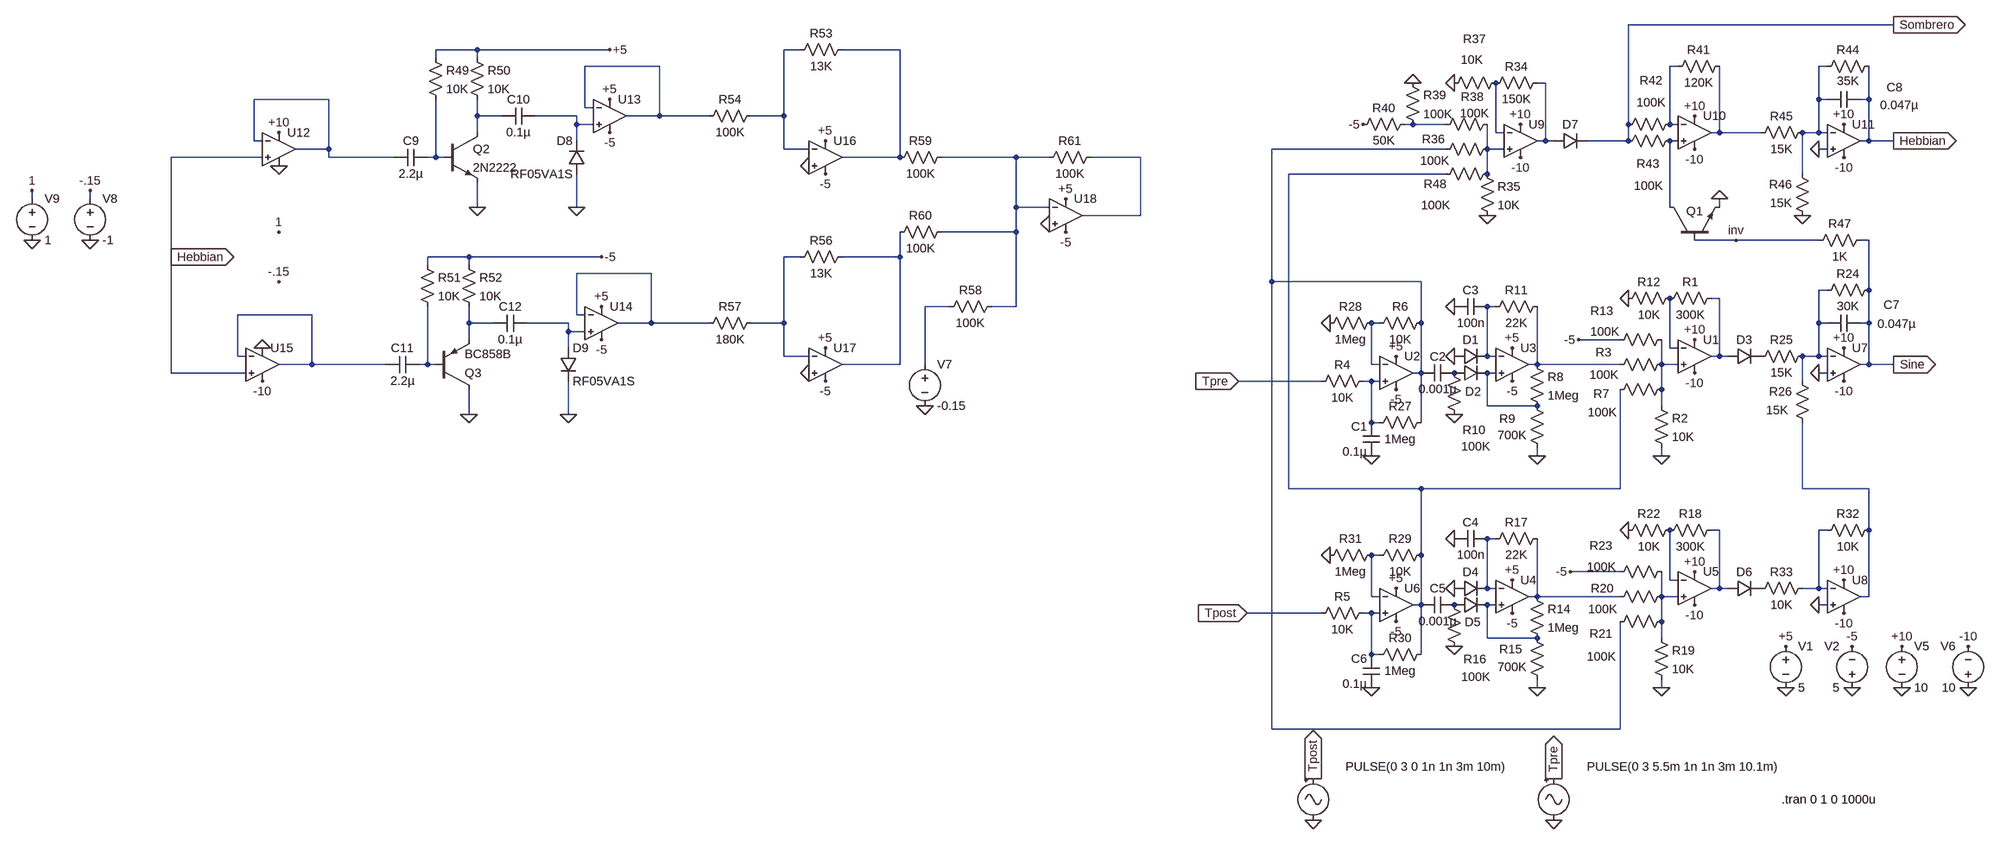
[diagram p0: schematic Draft1.asc]
Draft1.asc, the LTspice schematic file:
Version 4
SHEET 1 884 916
WIRE 704 -640 192 -640
WIRE -3808 -592 -3888 -592
WIRE -3552 -592 -3808 -592
WIRE -3184 -592 -3216 -592
WIRE -2992 -592 -3104 -592
WIRE -3888 -576 -3888 -592
WIRE -3808 -576 -3808 -592
WIRE -3456 -560 -3600 -560
WIRE 288 -560 272 -560
WIRE 576 -560 560 -560
WIRE 32 -528 16 -528
WIRE -4128 -496 -4272 -496
WIRE 560 -496 560 -560
WIRE 576 -496 560 -496
WIRE 656 -496 656 -560
WIRE 656 -496 640 -496
WIRE -3600 -480 -3600 -560
WIRE -3584 -480 -3600 -480
WIRE -3808 -464 -3808 -496
WIRE -3760 -464 -3808 -464
WIRE -3616 -464 -3696 -464
WIRE -3456 -464 -3456 -560
WIRE -3456 -464 -3520 -464
WIRE -3360 -464 -3456 -464
WIRE -3216 -464 -3216 -592
WIRE -3216 -464 -3280 -464
WIRE -3616 -448 -3616 -464
WIRE -3584 -448 -3616 -448
WIRE -224 -448 -240 -448
WIRE -160 -448 -224 -448
WIRE 192 -448 192 -640
WIRE 272 -448 272 -560
WIRE 288 -448 272 -448
WIRE -3808 -432 -3808 -464
WIRE -64 -432 -64 -528
WIRE -48 -432 -64 -432
WIRE 368 -432 368 -560
WIRE 368 -432 352 -432
WIRE 448 -432 368 -432
WIRE 560 -432 560 -496
WIRE 560 -432 528 -432
WIRE 576 -432 560 -432
WIRE -4272 -416 -4272 -496
WIRE -4256 -416 -4272 -416
WIRE -3616 -416 -3616 -448
WIRE 32 -416 32 -528
WIRE 32 -416 16 -416
WIRE 48 -416 32 -416
WIRE 192 -416 192 -448
WIRE 192 -416 112 -416
WIRE 288 -416 272 -416
WIRE 656 -416 656 -496
WIRE 656 -416 640 -416
WIRE 704 -416 656 -416
WIRE -4128 -400 -4128 -496
WIRE -4128 -400 -4192 -400
WIRE -3216 -400 -3216 -464
WIRE -3168 -400 -3216 -400
WIRE -160 -400 -496 -400
WIRE -80 -400 -80 -448
WIRE -48 -400 -80 -400
WIRE 576 -400 560 -400
WIRE -4256 -384 -4432 -384
WIRE -4128 -384 -4128 -400
WIRE -3968 -384 -4128 -384
WIRE -3888 -384 -3888 -496
WIRE -3888 -384 -3904 -384
WIRE -3872 -384 -3888 -384
WIRE -2992 -384 -2992 -592
WIRE -2992 -384 -3104 -384
WIRE -2768 -384 -2912 -384
WIRE -2704 -384 -2768 -384
WIRE -2528 -384 -2624 -384
WIRE -160 -352 -464 -352
WIRE -80 -352 -80 -400
WIRE 528 -352 528 -432
WIRE -4832 -304 -4832 -320
WIRE -4720 -304 -4720 -320
WIRE -3808 -288 -3808 -336
WIRE -3616 -288 -3616 -352
WIRE -2768 -288 -2768 -384
WIRE -2704 -288 -2768 -288
WIRE 272 -288 272 -416
WIRE 368 -288 368 -304
WIRE -2528 -272 -2528 -384
WIRE -2528 -272 -2640 -272
WIRE -2768 -240 -2768 -288
WIRE -2768 -240 -2912 -240
WIRE 400 -224 320 -224
WIRE 560 -224 400 -224
WIRE 656 -224 640 -224
WIRE -4432 -192 -4432 -384
WIRE -3824 -192 -3904 -192
WIRE -3568 -192 -3824 -192
WIRE -3184 -192 -3216 -192
WIRE -2992 -192 -2992 -240
WIRE -2992 -192 -3104 -192
WIRE -3904 -176 -3904 -192
WIRE -3824 -176 -3824 -192
WIRE -3472 -160 -3616 -160
WIRE -496 -144 -496 -400
WIRE -208 -144 -496 -144
WIRE 576 -128 560 -128
WIRE 656 -128 656 -224
WIRE 368 -112 352 -112
WIRE -2896 -96 -2944 -96
WIRE -2768 -96 -2768 -240
WIRE -2768 -96 -2816 -96
WIRE -64 -96 -80 -96
WIRE -4160 -80 -4304 -80
WIRE -3616 -80 -3616 -160
WIRE -3600 -80 -3616 -80
WIRE -3824 -64 -3824 -96
WIRE -3776 -64 -3824 -64
WIRE -3632 -64 -3712 -64
WIRE -3472 -64 -3472 -160
WIRE -3472 -64 -3536 -64
WIRE -3360 -64 -3472 -64
WIRE -3216 -64 -3216 -192
WIRE -3216 -64 -3280 -64
WIRE -288 -64 -304 -64
WIRE -208 -64 -208 -144
WIRE 560 -64 560 -128
WIRE 576 -64 560 -64
WIRE 656 -64 656 -128
WIRE 656 -64 640 -64
WIRE -3632 -48 -3632 -64
WIRE -3600 -48 -3632 -48
WIRE -3824 -32 -3824 -64
WIRE 176 -32 96 -32
WIRE -3632 -16 -3632 -48
WIRE 272 -16 272 -112
WIRE 288 -16 272 -16
WIRE -4304 0 -4304 -80
WIRE -4288 0 -4304 0
WIRE -3216 0 -3216 -64
WIRE -3168 0 -3216 0
WIRE -80 0 -80 -96
WIRE -64 0 -80 0
WIRE 368 0 368 -112
WIRE 368 0 352 0
WIRE 384 0 368 0
WIRE 560 0 560 -64
WIRE 560 0 528 0
WIRE 576 0 560 0
WIRE -4160 16 -4160 -80
WIRE -4160 16 -4224 16
WIRE -3984 16 -4160 16
WIRE -3904 16 -3904 -96
WIRE -3904 16 -3920 16
WIRE -3888 16 -3904 16
WIRE -2992 16 -2992 -192
WIRE -2992 16 -3104 16
WIRE -2944 16 -2944 -96
WIRE -304 16 -304 -64
WIRE -288 16 -304 16
WIRE 16 16 16 -96
WIRE 16 16 0 16
WIRE 176 16 16 16
WIRE 256 16 256 -32
WIRE 288 16 256 16
WIRE 656 16 656 -64
WIRE 656 16 640 16
WIRE 704 16 656 16
WIRE -4432 32 -4432 -192
WIRE -4288 32 -4432 32
WIRE -208 32 -208 -64
WIRE -208 32 -224 32
WIRE -64 32 -80 32
WIRE 576 32 560 32
WIRE -400 48 -560 48
WIRE -304 48 -320 48
WIRE -288 48 -304 48
WIRE 528 48 528 0
WIRE 256 64 256 16
WIRE -80 96 -80 32
WIRE 16 96 -80 96
WIRE 256 96 256 64
WIRE -3824 112 -3824 64
WIRE -3632 112 -3632 48
WIRE -304 128 -304 48
WIRE -288 128 -304 128
WIRE -208 128 -208 32
WIRE 16 192 16 176
WIRE 256 192 256 176
WIRE -464 256 -464 -352
WIRE -208 256 -464 256
WIRE 176 256 176 64
WIRE 176 256 -208 256
WIRE 528 256 528 128
WIRE 656 256 528 256
WIRE 368 336 352 336
WIRE 576 336 560 336
WIRE 656 336 656 256
WIRE -64 352 -80 352
WIRE -288 384 -304 384
WIRE -208 384 -208 256
WIRE 176 416 80 416
WIRE 272 432 272 336
WIRE 288 432 272 432
WIRE -80 448 -80 352
WIRE -64 448 -80 448
WIRE 368 448 368 336
WIRE 368 448 352 448
WIRE 384 448 368 448
WIRE 560 448 560 336
WIRE 560 448 528 448
WIRE 576 448 560 448
WIRE -304 464 -304 384
WIRE -288 464 -304 464
WIRE 16 464 16 352
WIRE 16 464 0 464
WIRE 176 464 16 464
WIRE 256 464 256 416
WIRE 288 464 256 464
WIRE 656 464 656 336
WIRE 656 464 640 464
WIRE -208 480 -208 384
WIRE -208 480 -224 480
WIRE -64 480 -80 480
WIRE 576 480 560 480
WIRE -400 496 -544 496
WIRE -304 496 -320 496
WIRE -288 496 -304 496
WIRE 256 512 256 464
WIRE -80 544 -80 480
WIRE 16 544 -80 544
WIRE 256 544 256 512
WIRE -304 576 -304 496
WIRE -288 576 -304 576
WIRE -208 576 -208 480
WIRE 16 640 16 624
WIRE 256 640 256 624
WIRE -496 720 -496 -144
WIRE 176 720 176 512
WIRE 176 720 -496 720
FLAG 48 896 0
FLAG -416 896 0
FLAG -256 0 +5
FLAG -256 64 -5
FLAG -32 -16 +5
FLAG -32 48 -5
FLAG -144 0 0
FLAG -144 -96 0
FLAG -144 112 0
FLAG 192 -112 0
FLAG 96 -32 -5
FLAG -32 432 +5
FLAG -32 496 -5
FLAG -144 448 0
FLAG -144 352 0
FLAG -144 560 0
FLAG 16 640 0
FLAG 16 192 0
FLAG 192 336 0
FLAG 80 416 -5
FLAG -304 192 0
FLAG -384 -64 0
FLAG -256 448 +5
FLAG -256 512 -5
FLAG -304 640 0
FLAG -384 384 0
FLAG 560 480 0
FLAG 560 32 0
FLAG 256 192 0
FLAG 256 640 0
FLAG 704 16 Sine
IOPIN 704 16 Out
FLAG -144 -528 0
FLAG -224 -528 0
FLAG -320 -448 -5
FLAG 560 -400 0
FLAG 528 -272 0
FLAG 368 -304 0
FLAG 704 -416 Hebbian
IOPIN 704 -416 Out
FLAG 704 -640 Sombrero
IOPIN 704 -640 Out
FLAG 496 640 0
FLAG 624 640 0
FLAG 624 560 -5
FLAG 496 560 +5
FLAG -544 496 Tpost
IOPIN -544 496 In
FLAG -416 816 Tpost
IOPIN -416 816 Out
FLAG -560 48 Tpre
IOPIN -560 48 In
FLAG 48 816 Tpre
IOPIN 48 816 Out
FLAG -80 -272 0
FLAG 400 -224 inv
FLAG 720 640 0
FLAG 848 640 0
FLAG 848 560 -10
FLAG 720 560 +10
FLAG 320 -32 +10
FLAG 608 -16 +10
FLAG 608 432 +10
FLAG 320 416 +10
FLAG 320 480 -10
FLAG 608 496 -10
FLAG 320 32 -10
FLAG 608 48 -10
FLAG -16 -448 +10
FLAG 320 -464 +10
FLAG 608 -448 +10
FLAG 608 -384 -10
FLAG 320 -400 -10
FLAG -16 -384 -10
FLAG -3616 -288 0
FLAG -3808 -288 0
FLAG -3552 -592 +5
FLAG -3552 -496 +5
FLAG -3552 -432 -5
FLAG -3632 112 0
FLAG -3824 112 0
FLAG -3568 -96 +5
FLAG -3568 -32 -5
FLAG -3568 -192 -5
FLAG -3136 -416 +5
FLAG -3136 -352 -5
FLAG -3168 -368 0
FLAG -2944 96 0
FLAG -3136 -16 +5
FLAG -3136 48 -5
FLAG -3168 32 0
FLAG -4432 -192 Hebbian
IOPIN -4432 -192 Out
FLAG -4224 -432 +10
FLAG -4256 48 -10
FLAG -4720 -224 0
FLAG -4720 -320 -.15
FLAG -4224 -144 -.15
FLAG -4832 -224 0
FLAG -4832 -320 1
FLAG -4224 -240 1
FLAG -2672 -304 +5
FLAG -2672 -240 -5
FLAG -2704 -256 0
FLAG -4256 -16 0
FLAG -4224 -368 0
SYMBOL Opamps\\UniversalOpamp2 320 0 R0
SYMATTR InstName U1
SYMBOL res 368 -128 R90
WINDOW 0 0 56 VBottom 2
WINDOW 3 32 56 VTop 2
SYMATTR InstName R1
SYMATTR Value 300K
SYMBOL res 240 80 R0
SYMATTR InstName R2
SYMATTR Value 10K
SYMBOL res 272 0 R90
WINDOW 0 8 128 VBottom 2
WINDOW 3 20 127 VTop 2
SYMATTR InstName R3
SYMATTR Value 100K
SYMBOL Opamps\\UniversalOpamp2 -256 32 R0
SYMATTR InstName U2
SYMBOL cap -288 192 R180
WINDOW 0 24 56 Left 2
WINDOW 3 24 8 Left 2
SYMATTR InstName C1
SYMATTR Value 0.1µ
SYMBOL res -304 32 R90
WINDOW 0 0 56 VBottom 2
WINDOW 3 32 56 VTop 2
SYMATTR InstName R4
SYMATTR Value 10K
SYMBOL res -304 480 R90
WINDOW 0 0 56 VBottom 2
WINDOW 3 32 56 VTop 2
SYMATTR InstName R5
SYMATTR Value 10K
SYMBOL res -192 -80 R90
WINDOW 0 0 56 VBottom 2
WINDOW 3 32 56 VTop 2
SYMATTR InstName R6
SYMATTR Value 10K
SYMBOL res 272 48 R90
WINDOW 0 40 132 VBottom 2
WINDOW 3 45 130 VTop 2
SYMATTR InstName R7
SYMATTR Value 100K
SYMBOL Opamps\\UniversalOpamp2 -32 16 R0
SYMATTR InstName U3
SYMBOL diode -144 16 R270
WINDOW 0 32 32 VTop 2
WINDOW 3 0 32 Invisible 2
SYMATTR InstName D1
SYMBOL diode -144 48 R270
WINDOW 0 -36 37 VTop 2
WINDOW 3 0 32 Invisible 2
SYMATTR InstName D2
SYMBOL res 0 0 R0
SYMATTR InstName R8
SYMATTR Value 1Meg
SYMBOL res 32 192 R180
WINDOW 0 58 71 Left 2
WINDOW 3 36 40 Left 2
SYMATTR InstName R9
SYMATTR Value 700K
SYMBOL res -160 16 R0
WINDOW 0 32 126 Left 2
WINDOW 3 30 158 Left 2
SYMATTR InstName R10
SYMATTR Value 100K
SYMBOL cap -144 16 R90
WINDOW 0 0 32 VBottom 2
WINDOW 3 32 32 VTop 2
SYMATTR InstName C2
SYMATTR Value 0.001µ
SYMBOL res 32 -112 R90
WINDOW 0 0 56 VBottom 2
WINDOW 3 32 56 VTop 2
SYMATTR InstName R11
SYMATTR Value 22K
SYMBOL cap -80 -112 R90
WINDOW 0 0 32 VBottom 2
WINDOW 3 32 32 VTop 2
SYMATTR InstName C3
SYMATTR Value 100n
SYMBOL res 176 -96 R270
WINDOW 0 32 56 VTop 2
WINDOW 3 0 56 VBottom 2
SYMATTR InstName R12
SYMATTR Value 10K
SYMBOL diode 384 16 R270
WINDOW 0 32 32 VTop 2
WINDOW 3 0 32 Invisible 2
SYMATTR InstName D3
SYMBOL res 272 -48 R90
WINDOW 0 -24 131 VBottom 2
WINDOW 3 -15 125 VTop 2
SYMATTR InstName R13
SYMATTR Value 100K
SYMBOL Opamps\\UniversalOpamp2 -32 464 R0
SYMATTR InstName U4
SYMBOL diode -144 464 R270
WINDOW 0 32 32 VTop 2
WINDOW 3 0 32 Invisible 2
SYMATTR InstName D4
SYMBOL diode -144 496 R270
WINDOW 0 -33 36 VTop 2
WINDOW 3 0 32 Invisible 2
SYMATTR InstName D5
SYMBOL res 0 448 R0
SYMATTR InstName R14
SYMATTR Value 1Meg
SYMBOL res 32 640 R180
WINDOW 0 45 74 Left 2
WINDOW 3 36 40 Left 2
SYMATTR InstName R15
SYMATTR Value 700K
SYMBOL res -160 464 R0
WINDOW 0 34 121 Left 2
WINDOW 3 30 155 Left 2
SYMATTR InstName R16
SYMATTR Value 100K
SYMBOL res 32 336 R90
WINDOW 0 0 56 VBottom 2
WINDOW 3 32 56 VTop 2
SYMATTR InstName R17
SYMATTR Value 22K
SYMBOL cap -80 336 R90
WINDOW 0 0 32 VBottom 2
WINDOW 3 32 32 VTop 2
SYMATTR InstName C4
SYMATTR Value 100n
SYMBOL cap -144 464 R90
WINDOW 0 0 32 VBottom 2
WINDOW 3 32 32 VTop 2
SYMATTR InstName C5
SYMATTR Value 0.001µ
SYMBOL Opamps\\UniversalOpamp2 320 448 R0
SYMATTR InstName U5
SYMBOL res 368 320 R90
WINDOW 0 0 56 VBottom 2
WINDOW 3 32 56 VTop 2
SYMATTR InstName R18
SYMATTR Value 300K
SYMBOL res 240 528 R0
SYMATTR InstName R19
SYMATTR Value 10K
SYMBOL res 272 448 R90
WINDOW 0 16 130 VBottom 2
WINDOW 3 25 129 VTop 2
SYMATTR InstName R20
SYMATTR Value 100K
SYMBOL res 272 496 R90
WINDOW 0 55 133 VBottom 2
WINDOW 3 68 132 VTop 2
SYMATTR InstName R21
SYMATTR Value 100K
SYMBOL res 176 352 R270
WINDOW 0 32 56 VTop 2
WINDOW 3 0 56 VBottom 2
SYMATTR InstName R22
SYMATTR Value 10K
SYMBOL diode 384 464 R270
WINDOW 0 32 32 VTop 2
WINDOW 3 0 32 Invisible 2
SYMATTR InstName D6
SYMBOL res 272 400 R90
WINDOW 0 -19 133 VBottom 2
WINDOW 3 -9 132 VTop 2
SYMATTR InstName R23
SYMATTR Value 100K
SYMBOL res 672 -144 R90
WINDOW 0 0 56 VBottom 2
WINDOW 3 32 56 VTop 2
SYMATTR InstName R24
SYMATTR Value 30K
SYMBOL res 544 -16 R90
WINDOW 0 0 56 VBottom 2
WINDOW 3 32 56 VTop 2
SYMATTR InstName R25
SYMATTR Value 15K
SYMBOL res 544 144 R180
WINDOW 0 36 76 Left 2
WINDOW 3 43 40 Left 2
SYMATTR InstName R26
SYMATTR Value 15K
SYMBOL res -192 112 R90
WINDOW 0 0 56 VBottom 2
WINDOW 3 32 56 VTop 2
SYMATTR InstName R27
SYMATTR Value 1Meg
SYMBOL res -288 -80 R90
WINDOW 0 0 56 VBottom 2
WINDOW 3 32 56 VTop 2
SYMATTR InstName R28
SYMATTR Value 1Meg
SYMBOL Opamps\\UniversalOpamp2 -256 480 R0
SYMATTR InstName U6
SYMBOL cap -288 640 R180
WINDOW 0 24 56 Left 2
WINDOW 3 24 8 Left 2
SYMATTR InstName C6
SYMATTR Value 0.1µ
SYMBOL res -192 368 R90
WINDOW 0 0 56 VBottom 2
WINDOW 3 32 56 VTop 2
SYMATTR InstName R29
SYMATTR Value 10K
SYMBOL res -192 560 R90
WINDOW 0 0 56 VBottom 2
WINDOW 3 32 56 VTop 2
SYMATTR InstName R30
SYMATTR Value 1Meg
SYMBOL res -288 368 R90
WINDOW 0 0 56 VBottom 2
WINDOW 3 32 56 VTop 2
SYMATTR InstName R31
SYMATTR Value 1Meg
SYMBOL Opamps\\UniversalOpamp2 608 16 R0
SYMATTR InstName U7
SYMBOL res 672 320 R90
WINDOW 0 0 56 VBottom 2
WINDOW 3 32 56 VTop 2
SYMATTR InstName R32
SYMATTR Value 10K
SYMBOL Opamps\\UniversalOpamp2 608 464 R0
SYMATTR InstName U8
SYMBOL res 544 432 R90
WINDOW 0 0 56 VBottom 2
WINDOW 3 32 56 VTop 2
SYMATTR InstName R33
SYMATTR Value 10K
SYMBOL cap 640 -80 R90
WINDOW 0 -4 -60 VBottom 2
WINDOW 3 2 -70 VTop 2
SYMATTR InstName C7
SYMATTR Value 0.047µ
SYMBOL Opamps\\UniversalOpamp2 -16 -416 R0
SYMATTR InstName U9
SYMATTR SpiceModel level.3b
SYMBOL res 32 -544 R90
WINDOW 0 0 56 VBottom 2
WINDOW 3 32 56 VTop 2
SYMATTR InstName R34
SYMATTR Value 150K
SYMBOL res -96 -368 R0
SYMATTR InstName R35
SYMATTR Value 10K
SYMBOL res -64 -416 R90
WINDOW 0 12 120 VBottom 2
WINDOW 3 23 117 VTop 2
SYMATTR InstName R36
SYMATTR Value 100K
SYMBOL res -160 -512 R270
WINDOW 0 85 55 VTop 2
WINDOW 3 76 50 VBottom 2
SYMATTR InstName R37
SYMATTR Value 10K
SYMBOL res -64 -464 R90
WINDOW 0 -21 45 VBottom 2
WINDOW 3 -21 41 VTop 2
SYMATTR InstName R38
SYMATTR Value 100K
SYMBOL res -240 -544 R0
SYMATTR InstName R39
SYMATTR Value 100K
SYMBOL res -224 -464 R90
WINDOW 0 0 56 VBottom 2
WINDOW 3 32 56 VTop 2
SYMATTR InstName R40
SYMATTR Value 50K
SYMBOL diode 48 -400 R270
WINDOW 0 32 32 VTop 2
WINDOW 3 0 32 Invisible 2
SYMATTR InstName D7
SYMBOL res 384 -576 R90
WINDOW 0 0 56 VBottom 2
WINDOW 3 32 56 VTop 2
SYMATTR InstName R41
SYMATTR Value 120K
SYMBOL Opamps\\UniversalOpamp2 320 -432 R0
SYMATTR InstName U10
SYMBOL res 288 -464 R90
WINDOW 0 -53 52 VBottom 2
WINDOW 3 -42 52 VTop 2
SYMATTR InstName R42
SYMATTR Value 100K
SYMBOL res 288 -432 R90
WINDOW 0 76 58 VBottom 2
WINDOW 3 87 57 VTop 2
SYMATTR InstName R43
SYMATTR Value 100K
SYMBOL npn 272 -224 R270
WINDOW 0 56 32 VRight 2
WINDOW 3 56 68 Invisible 2
SYMATTR InstName Q1
SYMBOL res 672 -576 R90
WINDOW 0 0 56 VBottom 2
WINDOW 3 60 56 VBottom 2
SYMATTR InstName R44
SYMATTR Value 35K
SYMBOL res 544 -448 R90
WINDOW 0 0 56 VBottom 2
WINDOW 3 32 56 VTop 2
SYMATTR InstName R45
SYMATTR Value 15K
SYMBOL res 544 -256 R180
WINDOW 0 36 76 Left 2
WINDOW 3 36 40 Left 2
SYMATTR InstName R46
SYMATTR Value 15K
SYMBOL Opamps\\UniversalOpamp2 608 -416 R0
SYMATTR InstName U11
SYMBOL cap 640 -512 R90
WINDOW 0 8 -66 VBottom 2
WINDOW 3 11 -75 VTop 2
SYMATTR InstName C8
SYMATTR Value 0.047µ
SYMBOL res 544 -208 R270
WINDOW 0 32 56 VTop 2
WINDOW 3 0 56 VBottom 2
SYMATTR InstName R47
SYMATTR Value 1K
SYMBOL voltage 496 544 R0
WINDOW 123 0 0 Left 2
WINDOW 39 0 0 Left 2
SYMATTR InstName V1
SYMATTR Value 5
SYMBOL voltage 624 656 R180
WINDOW 0 24 96 Left 2
WINDOW 3 24 16 Left 2
WINDOW 123 0 0 Left 2
WINDOW 39 0 0 Left 2
SYMATTR InstName V2
SYMATTR Value 5
SYMBOL Misc\\signal -416 800 R0
WINDOW 0 24 16 Invisible 2
WINDOW 3 62 -8 Left 2
WINDOW 123 0 0 Left 2
WINDOW 39 0 0 Left 2
SYMATTR InstName V3
SYMATTR Value PULSE(0 3 0 1n 1n 3m 10m)
SYMBOL Misc\\signal 48 800 R0
WINDOW 0 24 16 Invisible 2
WINDOW 3 64 -8 Left 2
WINDOW 123 0 0 Left 2
WINDOW 39 0 0 Left 2
SYMATTR InstName V4
SYMATTR Value PULSE(0 3 5.5m 1n 1n 3m 10.1m)
SYMBOL res -64 -368 R90
WINDOW 0 51 117 VBottom 2
WINDOW 3 61 116 VTop 2
SYMATTR InstName R48
SYMATTR Value 100K
SYMBOL voltage 720 544 R0
WINDOW 123 0 0 Left 2
WINDOW 39 0 0 Left 2
SYMATTR InstName V5
SYMATTR Value 10
SYMBOL voltage 848 656 R180
WINDOW 0 24 96 Left 2
WINDOW 3 24 16 Left 2
WINDOW 123 0 0 Left 2
WINDOW 39 0 0 Left 2
SYMATTR InstName V6
SYMATTR Value 10
SYMBOL cap -3904 -400 R90
WINDOW 0 0 32 VBottom 2
WINDOW 3 32 32 VTop 2
SYMATTR InstName C9
SYMATTR Value 2.2µ
SYMBOL res -3904 -592 R0
SYMATTR InstName R49
SYMATTR Value 10K
SYMBOL res -3824 -592 R0
SYMATTR InstName R50
SYMATTR Value 10K
SYMBOL npn -3872 -432 R0
SYMATTR InstName Q2
SYMATTR Value 2N2222
SYMBOL cap -3696 -480 R90
WINDOW 0 0 32 VBottom 2
WINDOW 3 32 32 VTop 2
SYMATTR InstName C10
SYMATTR Value 0.1µ
SYMBOL diode -3600 -352 R180
WINDOW 0 24 64 Left 2
WINDOW 3 24 0 Left 2
SYMATTR InstName D8
SYMATTR Value RF05VA1S
SYMBOL Opamps\\UniversalOpamp2 -4224 -400 R0
SYMATTR InstName U12
SYMBOL Opamps\\UniversalOpamp2 -3552 -464 R0
SYMATTR InstName U13
SYMBOL cap -3920 0 R90
WINDOW 0 0 32 VBottom 2
WINDOW 3 32 32 VTop 2
SYMATTR InstName C11
SYMATTR Value 2.2µ
SYMBOL res -3920 -192 R0
SYMATTR InstName R51
SYMATTR Value 10K
SYMBOL res -3840 -192 R0
SYMATTR InstName R52
SYMATTR Value 10K
SYMBOL cap -3712 -80 R90
WINDOW 0 0 32 VBottom 2
WINDOW 3 32 32 VTop 2
SYMATTR InstName C12
SYMATTR Value 0.1µ
SYMBOL diode -3648 -16 R0
SYMATTR InstName D9
SYMATTR Value RF05VA1S
SYMBOL Opamps\\UniversalOpamp2 -3568 -64 R0
SYMATTR InstName U14
SYMBOL pnp -3888 64 M180
SYMATTR InstName Q3
SYMATTR Value BC858B
SYMBOL Opamps\\UniversalOpamp2 -4256 16 R0
SYMATTR InstName U15
SYMBOL Opamps\\UniversalOpamp2 -3136 -384 R0
SYMATTR InstName U16
SYMBOL res -3088 -608 R90
WINDOW 0 0 56 VBottom 2
WINDOW 3 32 56 VTop 2
SYMATTR InstName R53
SYMATTR Value 13K
SYMBOL res -3264 -480 R90
WINDOW 0 0 56 VBottom 2
WINDOW 3 32 56 VTop 2
SYMATTR InstName R54
SYMATTR Value 100K
SYMBOL voltage -2944 0 R0
WINDOW 123 0 0 Left 2
WINDOW 39 0 0 Left 2
SYMATTR InstName V7
SYMATTR Value -0.15
SYMBOL Opamps\\UniversalOpamp2 -3136 16 R0
SYMATTR InstName U17
SYMBOL res -3088 -208 R90
WINDOW 0 0 56 VBottom 2
WINDOW 3 32 56 VTop 2
SYMATTR InstName R56
SYMATTR Value 13K
SYMBOL res -3264 -80 R90
WINDOW 0 0 56 VBottom 2
WINDOW 3 32 56 VTop 2
SYMATTR InstName R57
SYMATTR Value 180K
SYMBOL res -2800 -112 R90
WINDOW 0 0 56 VBottom 2
WINDOW 3 32 56 VTop 2
SYMATTR InstName R58
SYMATTR Value 100K
SYMBOL voltage -4720 -320 R0
WINDOW 123 0 0 Left 2
WINDOW 39 0 0 Left 2
SYMATTR InstName V8
SYMATTR Value -1
SYMBOL voltage -4832 -320 R0
WINDOW 123 0 0 Left 2
WINDOW 39 0 0 Left 2
SYMATTR InstName V9
SYMATTR Value 1
SYMBOL Opamps\\UniversalOpamp2 -2672 -272 R0
SYMATTR InstName U18
SYMBOL res -2896 -400 R90
WINDOW 0 0 56 VBottom 2
WINDOW 3 32 56 VTop 2
SYMATTR InstName R59
SYMATTR Value 100K
SYMBOL res -2896 -256 R90
WINDOW 0 0 56 VBottom 2
WINDOW 3 32 56 VTop 2
SYMATTR InstName R60
SYMATTR Value 100K
SYMBOL res -2608 -400 R90
WINDOW 0 0 56 VBottom 2
WINDOW 3 32 56 VTop 2
SYMATTR InstName R61
SYMATTR Value 100K
TEXT 488 856 Left 2 !.tran 0 1 0 1000u

The netlist it stands for:
* Draft1.asc
XU1 N034 N031 +10 -10 N024 level.2 Avol=1Meg GBW=10Meg Slew=10Meg ilimit=25m rail=0 Vos=0 phimargin=45 en=0 enk=0 in=0 ink=0 Rin=500Meg  ; pins IN+ IN- V+ V- OUT
R1 N024 N031 300K
R2 N034 0 10K
R3 N034 N033 100K
XU2 N036 N030 +5 -5 N014 level.2 Avol=1Meg GBW=10Meg Slew=10Meg ilimit=25m rail=0 Vos=0 phimargin=45 en=0 enk=0 in=0 ink=0 Rin=500Meg  ; pins IN+ IN- V+ V- OUT
C1 0 N036 0.1µ
R4 N036 Tpre 10K
R5 N046 Tpost 10K
R6 N014 N030 10K
R7 N034 N019 100K
XU3 N035 N026 +5 -5 N033 level.2 Avol=1Meg GBW=10Meg Slew=10Meg ilimit=25m rail=0 Vos=0 phimargin=45 en=0 enk=0 in=0 ink=0 Rin=500Meg  ; pins IN+ IN- V+ V- OUT
D1 0 N026 D
D2 P001 N035 D
R8 N033 N035 1Meg
R9 0 N035 700K
R10 P001 0 100K
C2 P001 N014 0.001µ
R11 N033 N026 22K
C3 N026 0 100n
R12 0 N031 10K
D3 N024 P002 D
R13 N034 -5 100K
XU4 N045 N040 +5 -5 N043 level.2 Avol=1Meg GBW=10Meg Slew=10Meg ilimit=25m rail=0 Vos=0 phimargin=45 en=0 enk=0 in=0 ink=0 Rin=500Meg  ; pins IN+ IN- V+ V- OUT
D4 0 N040 D
D5 P003 N045 D
R14 N043 N045 1Meg
R15 0 N045 700K
R16 P003 0 100K
R17 N043 N040 22K
C4 N040 0 100n
C5 P003 N019 0.001µ
XU5 N044 N042 +10 -10 N038 level.2 Avol=1Meg GBW=10Meg Slew=10Meg ilimit=25m rail=0 Vos=0 phimargin=45 en=0 enk=0 in=0 ink=0 Rin=500Meg  ; pins IN+ IN- V+ V- OUT
R18 N038 N042 300K
R19 N044 0 10K
R20 N044 N043 100K
R21 N044 N014 100K
R22 0 N042 10K
D6 N038 P004 D
R23 N044 -5 100K
R24 Sine N023 30K
R25 N023 P002 15K
R26 N037 N023 15K
R27 N014 N036 1Meg
R28 N030 0 1Meg
XU6 N046 N041 +5 -5 N019 level.2 Avol=1Meg GBW=10Meg Slew=10Meg ilimit=25m rail=0 Vos=0 phimargin=45 en=0 enk=0 in=0 ink=0 Rin=500Meg  ; pins IN+ IN- V+ V- OUT
C6 0 N046 0.1µ
R29 N019 N041 10K
R30 N019 N046 1Meg
R31 N041 0 1Meg
XU7 0 N023 +10 -10 Sine level.2 Avol=1Meg GBW=10Meg Slew=10Meg ilimit=25m rail=0 Vos=0 phimargin=45 en=0 enk=0 in=0 ink=0 Rin=500Meg  ; pins IN+ IN- V+ V- OUT
R32 N037 N039 10K
XU8 0 N039 +10 -10 N037 level.2 Avol=1Meg GBW=10Meg Slew=10Meg ilimit=25m rail=0 Vos=0 phimargin=45 en=0 enk=0 in=0 ink=0 Rin=500Meg  ; pins IN+ IN- V+ V- OUT
R33 N039 P004 10K
C7 Sine N023 0.047µ
XU9 N015 N011 +10 -10 N006 level.3b Avol=1Meg GBW=10Meg Slew=10Meg ilimit=25m rail=0 Vos=0 phimargin=45 en=0 enk=0 in=0 ink=0 Rin=500Meg  ; pins IN+ IN- V+ V- OUT
R34 N006 N011 150K
R35 N015 0 10K
R36 N015 N014 100K
R37 0 N011 10K
R38 N015 N010 100K
R39 0 N010 100K
R40 N010 -5 50K
D7 N006 Sombrero D
R41 N012 N004 120K
XU10 N013 N004 +10 -10 N012 level.2 Avol=1Meg GBW=10Meg Slew=10Meg ilimit=25m rail=0 Vos=0 phimargin=45 en=0 enk=0 in=0 ink=0 Rin=500Meg  ; pins IN+ IN- V+ V- OUT
R42 N004 Sombrero 100K
R43 N013 Sombrero 100K
Q1 N013 inv 0 0 NPN
R44 Hebbian N005 35K
R45 N005 N012 15K
R46 0 N005 15K
XU11 0 N005 +10 -10 Hebbian level.2 Avol=1Meg GBW=10Meg Slew=10Meg ilimit=25m rail=0 Vos=0 phimargin=45 en=0 enk=0 in=0 ink=0 Rin=500Meg  ; pins IN+ IN- V+ V- OUT
C8 Hebbian N005 0.047µ
R47 inv Sine 1K
V1 +5 0 5
V2 0 -5 5
V3 Tpost 0 PULSE(0 3 0 1n 1n 3m 10m)
V4 Tpre 0 PULSE(0 3 5.5m 1n 1n 3m 10.1m)
R48 N015 N019 100K
V5 +10 0 10
V6 0 -10 10
C9 N016 N007 2.2µ
R49 +5 N016 10K
R50 +5 N008 10K
Q2 N008 N016 0 0 2N2222
C10 N009 N008 0.1µ
D8 0 N009 RF05VA1S
XU12 Hebbian N007 +10 0 N007 level.2 Avol=1Meg GBW=10Meg Slew=10Meg ilimit=25m rail=0 Vos=0 phimargin=45 en=0 enk=0 in=0 ink=0 Rin=500Meg  ; pins IN+ IN- V+ V- OUT
XU13 N009 N003 +5 -5 N003 level.2 Avol=1Meg GBW=10Meg Slew=10Meg ilimit=25m rail=0 Vos=0 phimargin=45 en=0 enk=0 in=0 ink=0 Rin=500Meg  ; pins IN+ IN- V+ V- OUT
C11 N032 N027 2.2µ
R51 -5 N032 10K
R52 -5 N028 10K
C12 N029 N028 0.1µ
D9 N029 0 RF05VA1S
XU14 N029 N022 +5 -5 N022 level.2 Avol=1Meg GBW=10Meg Slew=10Meg ilimit=25m rail=0 Vos=0 phimargin=45 en=0 enk=0 in=0 ink=0 Rin=500Meg  ; pins IN+ IN- V+ V- OUT
Q3 0 N032 N028 0 BC858B
XU15 Hebbian N027 0 -10 N027 level.2 Avol=1Meg GBW=10Meg Slew=10Meg ilimit=25m rail=0 Vos=0 phimargin=45 en=0 enk=0 in=0 ink=0 Rin=500Meg  ; pins IN+ IN- V+ V- OUT
XU16 0 N001 +5 -5 N002 level.2 Avol=1Meg GBW=10Meg Slew=10Meg ilimit=25m rail=0 Vos=0 phimargin=45 en=0 enk=0 in=0 ink=0 Rin=500Meg  ; pins IN+ IN- V+ V- OUT
R53 N002 N001 13K
R54 N001 N003 100K
V7 N025 0 -0.15
XU17 0 N020 +5 -5 N021 level.2 Avol=1Meg GBW=10Meg Slew=10Meg ilimit=25m rail=0 Vos=0 phimargin=45 en=0 enk=0 in=0 ink=0 Rin=500Meg  ; pins IN+ IN- V+ V- OUT
R56 N021 N020 13K
R57 N020 N022 180K
R58 N017 N025 100K
V8 -.15 0 -1
V9 1 0 1
XU18 0 N017 +5 -5 N018 level.2 Avol=1Meg GBW=10Meg Slew=10Meg ilimit=25m rail=0 Vos=0 phimargin=45 en=0 enk=0 in=0 ink=0 Rin=500Meg  ; pins IN+ IN- V+ V- OUT
R59 N017 N002 100K
R60 N017 N021 100K
R61 N018 N017 100K
.model D D
.lib standard.dio
.model NPN NPN
.model PNP PNP
.lib standard.bjt
.tran 0 1 0 1000u
.lib UniversalOpamps2.sub
.backanno
.end